# EAGLE design -Z_Panel_FM_Ver3 (EAGLE 9.6.2)
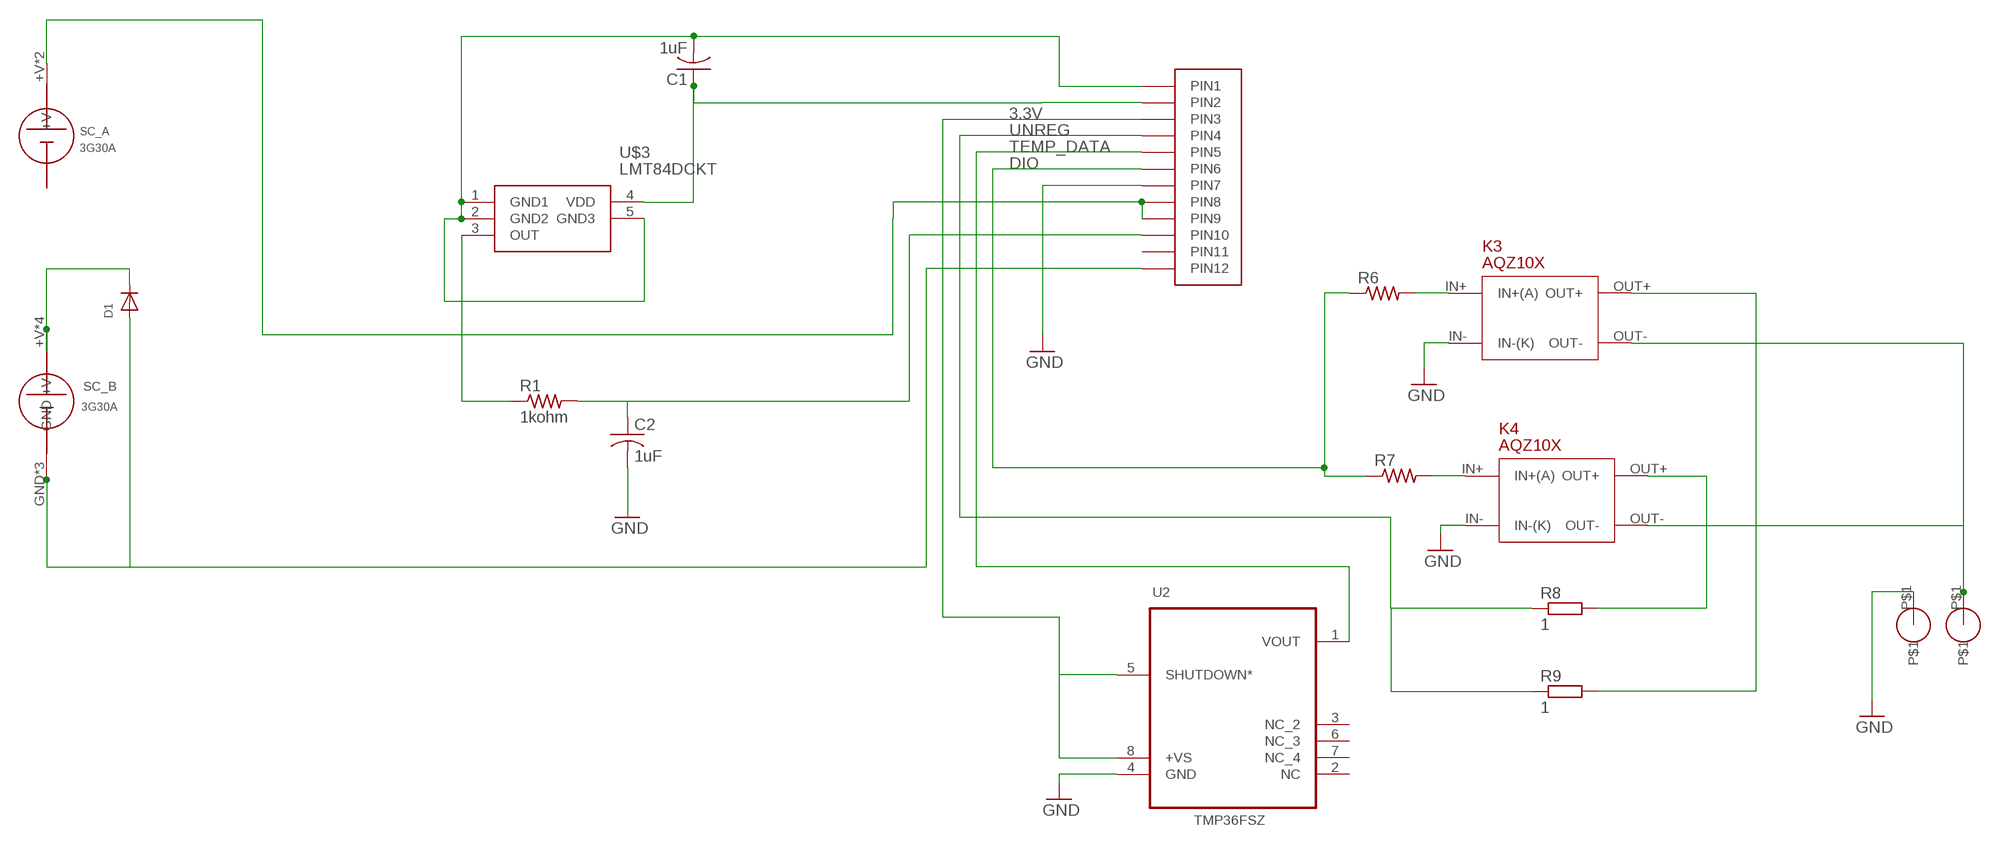
[diagram p0: schematic, sheet 1]

## Parts
C1  1uF  C-USC0805  [C0805]
C2  1uF  C-USC0805  [C0805]
D1  DIODE_SOD-123FL  [SOD-123FL]
GND9  NICR_HOLE  [NICR_HOLE]
HOLE1  NICR_HOLE  [NICR_HOLE]
K3  AQZ10X  [AQZ10X]
K4  AQZ10X  [AQZ10X]
R1  1kohm  R-US_R0402  [R0402]
R6  R-US_R0402  [R0402]
R7  R-US_R0402  [R0402]
R8  1  R-EU_R1218  [R1218]
R9  1  R-EU_R1218  [R1218]
U2  TMP36FSZ  [SOIC_N]
U$1  HEADER12PIN  [HEADER12PIN]
U$3  LMT84DCKT  [SOT65P210X110-5N]
U$4  SC_A  [SC_A]
U$5  SC_B  [SC_B]

## Nets
3.3V: U2.5(SHUTDOWN*) U2.8(+VS) U$1.P3(PIN3)
+V: U$1.P8(PIN8) U$1.P9(PIN9) U$4.+V U$4.+V1(+V)
+VB: D1.C U$5.+V U$5.+V2(+V) U$5.+V3(+V) U$5.+V4(+V)
DIO: R6.1 R7.1 U$1.P6(PIN6)
GND: C1.2 C2.2 D1.A GND9.P$1 K3.IN-(IN-(K)) K4.IN-(IN-(K)) U2.4(GND) U$1.P1(PIN1) U$1.P7(PIN7) U$1.P12(PIN12) U$3.1(GND1) U$3.2(GND2) U$3.5(GND3) U$5.GND U$5.GND1(GND) U$5.GND2(GND)
N$1: C2.1 R1.2 U$1.P10(PIN10)
N$2: C1.1 U$1.P2(PIN2) U$3.4(VDD)
N$6: K3.IN+(IN+(A)) R6.2
N$7: K4.IN+(IN+(A)) R7.2
N$8: K3.OUT+ R9.2
N$9: K4.OUT+ R8.2
N$10: R1.1 U$3.3(OUT)
N$11: HOLE1.P$1 K3.OUT- K4.OUT-
TEMP_DATA: U2.1(VOUT) U$1.P5(PIN5)
UNREG: R8.1 R9.1 U$1.P4(PIN4)
Unconnected: U2.2(NC) U2.3(NC_2) U2.6(NC_3) U2.7(NC_4) U$1.P11(PIN11)

## Library data of the parts
C1 C2 = adafruit:C-US: CAPACITOR, American symbol
D1 = adafruit:DIODE: Diode SMADIODE - SMA Surface Mount Package 20V 1A Schottky Diode Digikey: 641-1014-6-ND DO-1N4148 - Through Hole Small Current Diode SOD-123 20V 1 A (.5mV Vf) Schottky Diode - Digikey: MBRX120TPMSCT-ND SOD-323 10V 570mA (.38mV Vf, 3ns) Schottky Diode - Digikey: ZLLS410CT-ND SOD-523 30V 30mA Schottky Diode (RB751S-40TE61) - Digikey: RB751S-40TE61CT-ND SOT23-R/W - SOT23 Package (R = Solder Paste/Reflow Ovens, W = Hand-Soldering) BAT54Film 40V 300mA - Digikey: 497-7162-1-ND
GND9 HOLE1 = Nicr_hole:NICR_HOLE
K3 K4 = b4_photomos:AQZ10X
R1 = adafruit:R-US_: RESISTOR, American symbol
R6 R7 = adafruit_ufl:R-US_: RESISTOR, American symbol
R8 R9 = rcl:R-EU_: RESISTOR, European symbol; SPICEPREFIX: R
U2 = TMP36FSZ:TMP36FSZ
U$1 = BIRDS:HEADER12PIN
U$3 = LMT84DCKT:LMT84DCKT: 1.5V-Capable, 10 uA Analog Output Temperature Sensor in SC70 and TO-92 Source: Datasheet <http://uk.rs-online.com/web/p/products/8115860>; DESCRIPTION: 1.5V-Capable, 10 uA Analog Output Temperature Sensor in SC70 and TO-92; HEIGHT: 1.1mm; MANUFACTURER_NAME: Texas Instruments; MANUFACTURER_PART_NUMBER: LMT84DCKT; RS_PART_NUMBER: 8115860
U$4 = SC_A:SC_A
U$5 = SC_B:SC_B

## Board
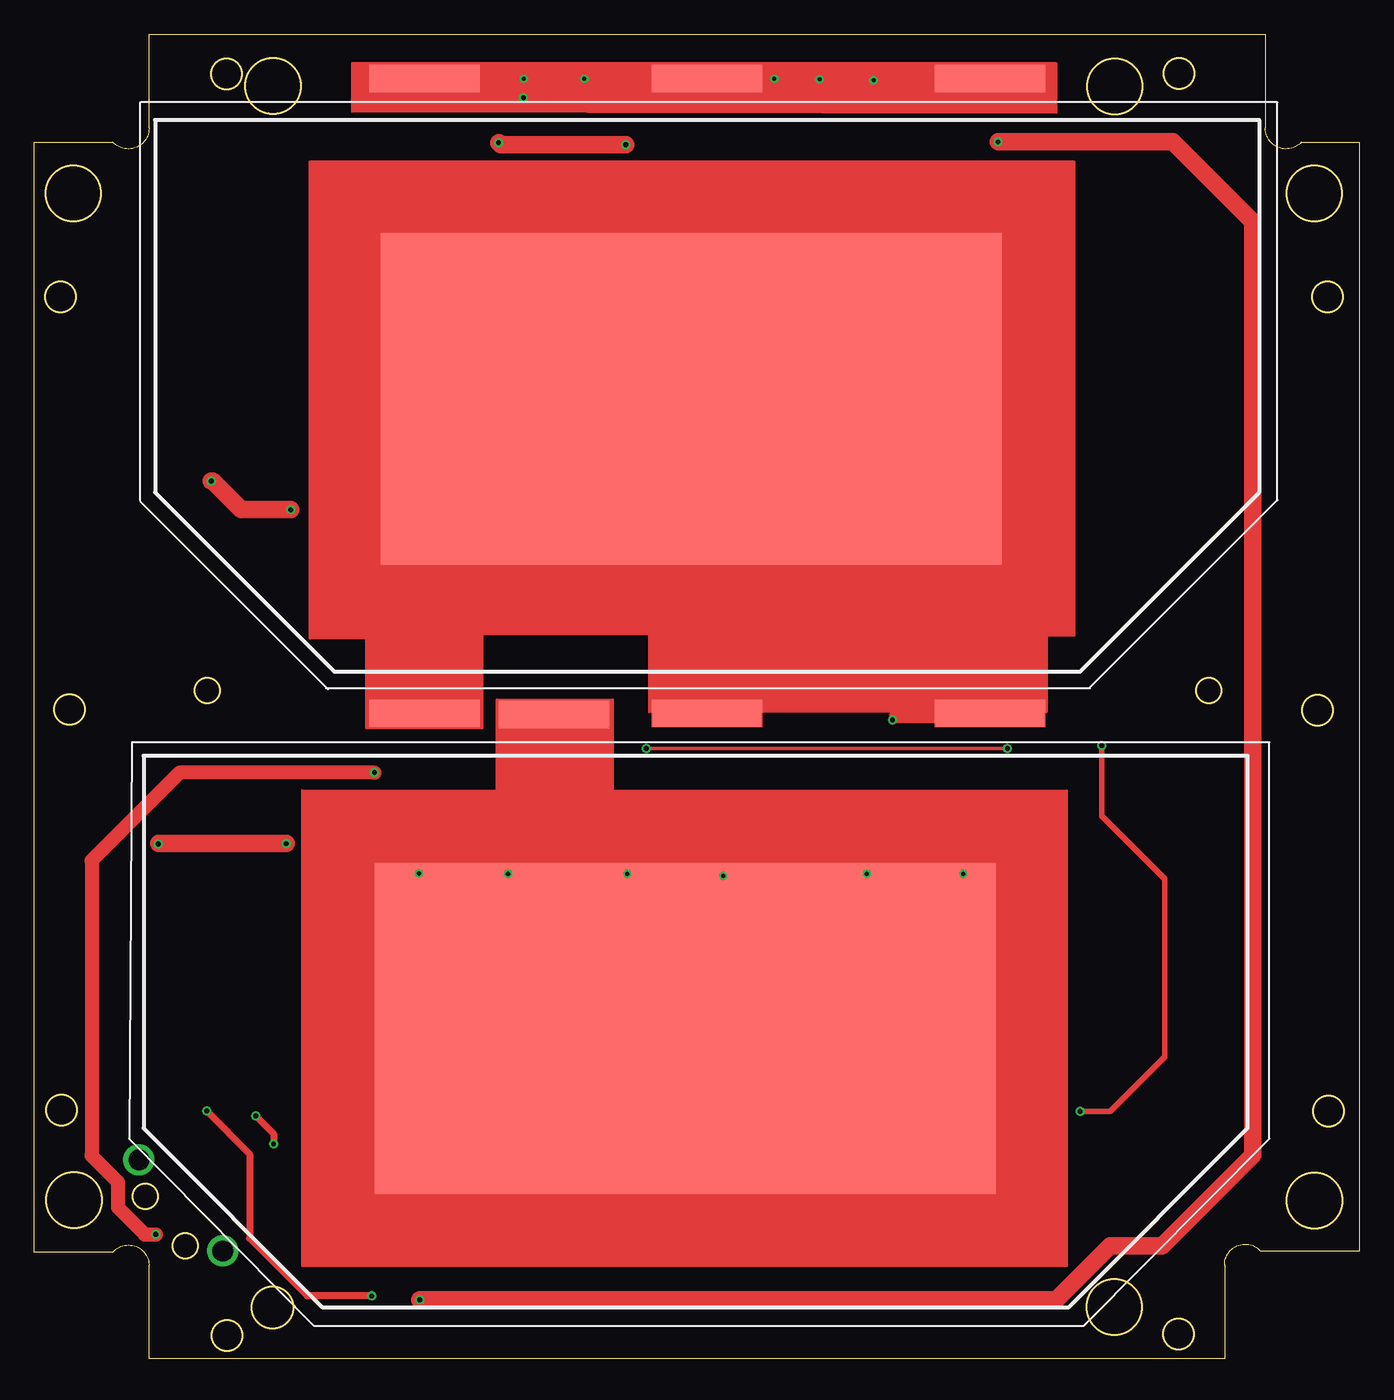
[diagram p1: board, top side]
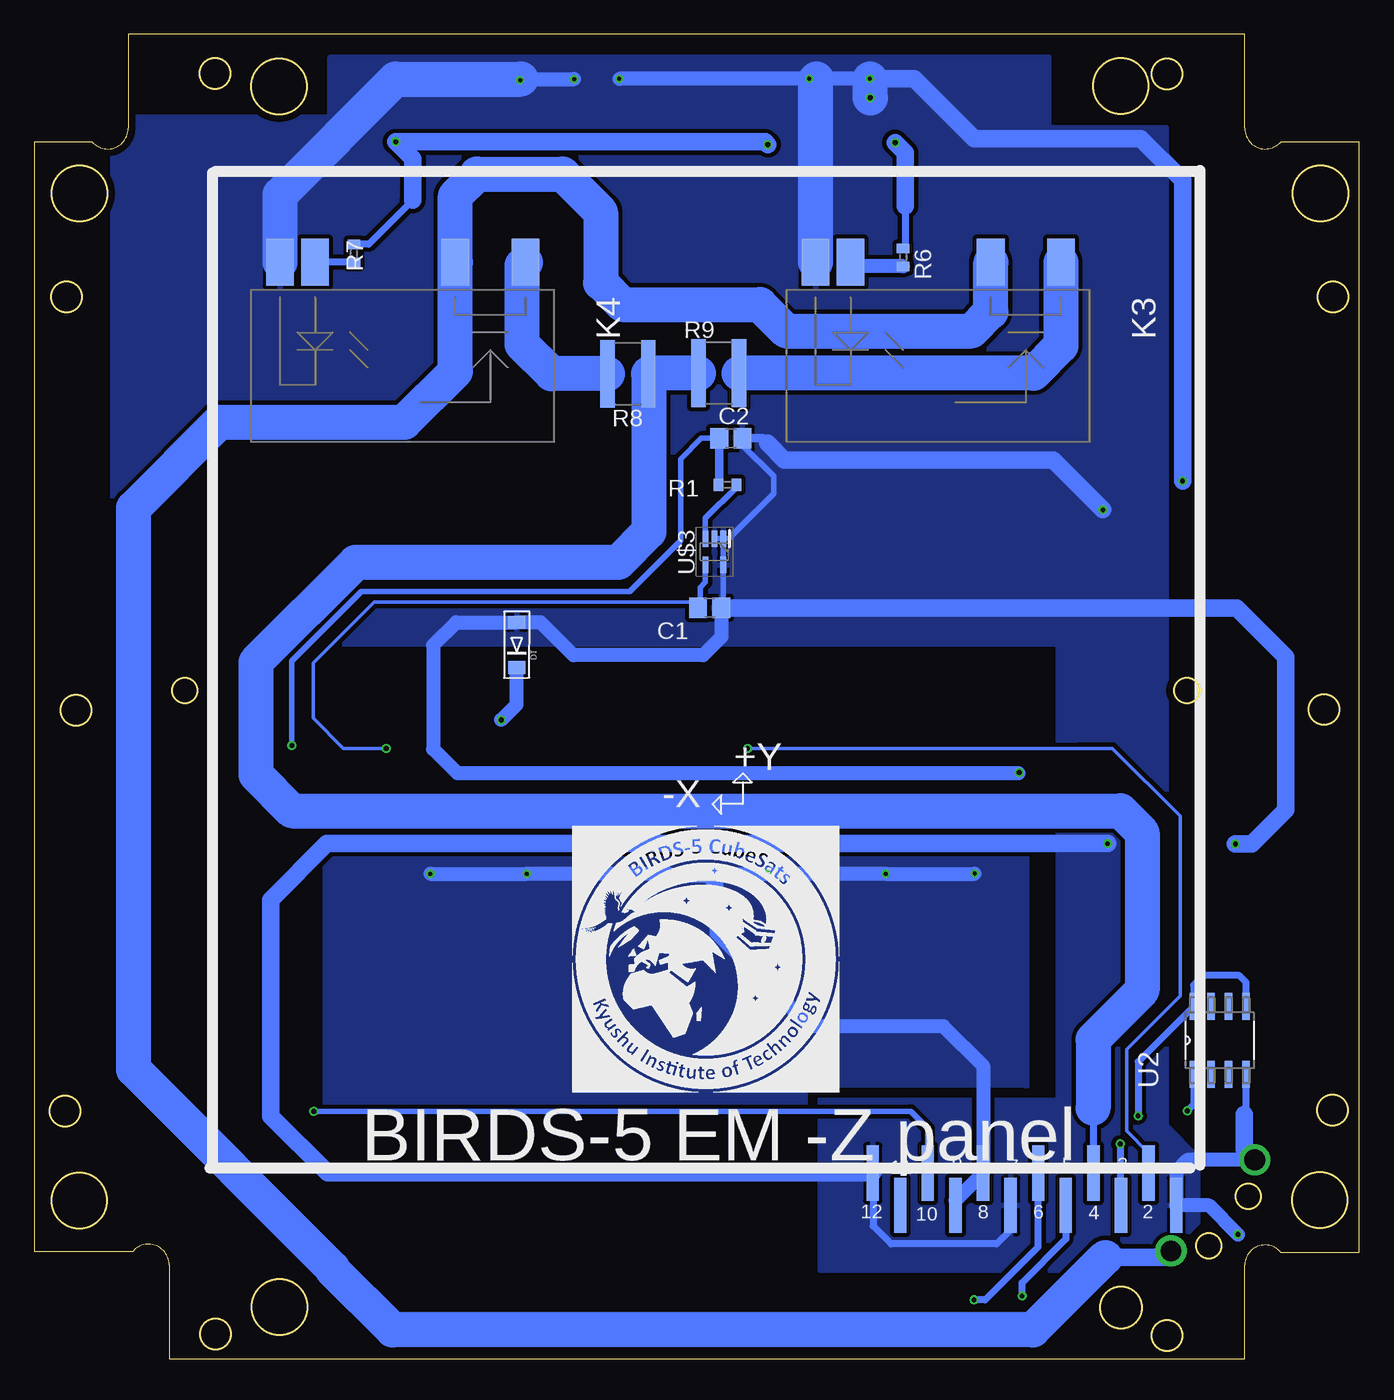
[diagram p2: board, bottom side, seen from below]

Size 96 x 96 mm. Coordinates in mm from the lower left corner, seen from the top.
Outline: 91.82,88.2 96,88.2 96,7.8 88.86,7.8 arc138 86.24,6.8 86.24,0 8.3,0 8.3,6.8 arc138 5.68,7.71 0,7.71 0,88.2 5.68,88.2 arc138 8.3,89.2 8.3,96 89.2,96 89.2,89.2 arc138 91.82,88.2
Outline: circle at 12.51,48.45 radius 0.9
Outline: circle at 8.03,11.78 radius 0.9
Outline: circle at 78.25,3.75 radius 2
Outline: circle at 17.26,3.73 radius 1.5
Outline: circle at 2.86,11.51 radius 2
Outline: circle at 2.55,47.07 radius 1.1
Outline: circle at 10.91,8.2 radius 0.9
Outline: circle at 1.88,76.98 radius 1.1
Outline: circle at 92.76,11.47 radius 2
Outline: circle at 82.93,93.16 radius 1.1
Outline: circle at 93.7,76.99 radius 1.1
Outline: circle at 1.94,18.04 radius 1.1
Outline: circle at 93.79,17.95 radius 1.1
Outline: circle at 92.74,84.48 radius 2
Outline: circle at 13.94,1.7 radius 1.1
Outline: circle at 17.27,92.27 radius 2
Outline: circle at 85.11,48.45 radius 0.9
Outline: circle at 2.81,84.49 radius 2
Outline: circle at 92.99,47.02 radius 1.1
Outline: circle at 13.92,93.14 radius 1.1
Copper layers (1*16): Top 0.035mm / dielectric 1.53mm / Bottom 0.035mm
Design rules "pban_5mil-l2": minimum track width 5mil, minimum drill 0.3mm, track to track 5mil, track to pad 0.229mm, pad to pad 5mil, via to via 5mil, smd to smd 5mil, copper to edge 0.5mm, drill to drill 0.5mm, minimum pad ring 0.15mm, minimum via ring 0.15mm, stop-mask expansion 4mil, vias tented up to drill 0.35mm, thermal gap 10mil

### Footprints (pad centres in the part's own frame; a part is rotated, then mirrored left to right if it is on the bottom)
C0805 = smd 1.3 x 1.5: 1 -0.85,0; 2 0.85,0
SOD-123FL = smd 0.91 x 1.22 bottom: A 1.637,0; C -1.637,0
NICR_HOLE = drill 1.5 pad 1.75: P$1 0,0
AQZ10X = smd 3.4 x 2: IN+ 0,-6.35; IN- 0,-8.89; OUT+ 0,8.89; OUT- 0,3.81
R0402 = smd 0.7 x 0.9: 1 -0.65,0; 2 0.65,0
R1218 = smd 1.05 x 4.9: 1 -1.475,0; 2 1.475,0
SOIC_N = smd 1.981 x 0.559: 1 -2.464,1.905; 2 -2.464,0.635; 3 -2.464,-0.635; 4 -2.464,-1.905; 5 2.464,-1.905; 6 2.464,-0.635; 7 2.464,0.635; 8 2.464,1.905
HEADER12PIN = smd 4 x 0.89: P1 0,0; P2 2.35,2; P3 0,4; P4 2.35,6; P5 0,8; P6 2.35,10; P7 0,12; P8 2.35,14; P9 0,16; P10 2.35,18; P11 0,20; P12 2.35,22
SOT65P210X110-5N = smd 1.2 x 0.4: 1 -0.95,0.65; 2 -0.95,0; 3 -0.95,-0.65; 4 0.95,-0.65; 5 0.95,0.65
SC_A = smd 45 x 24: +V 40.75,19.75 | smd 8 x 2: +V1 50.25,-3
SC_B = smd 45 x 24: +V 41.14,20.22 | smd 8 x 2: +V2 19.5,43; +V3 40,43; +V4 60.5,43; GND 60.5,-3; GND1 19.5,-3; GND2 40,-3

### Placement (x,y rotation side)
C1  47.07,54.43 0 bottom
C2  45.54,66.73 0 bottom
D1  61.06,51.74 90 top
GND9  7.56,14.41 0 top
HOLE1  13.64,7.81 0 top
K3  30.51,79.48 270 bottom
K4  69.32,79.48 270 bottom
R1  45.77,63.35 180 bottom
R6  33.05,79.84 270 bottom
R7  72.85,80.14 270 bottom
R8  53,71.4 180 bottom
R9  46.41,71.45 0 bottom
U2  10.1,23.08 90 bottom
U$1  13.26,11.11 90 bottom
U$3  46.74,58.5 270 bottom
U$4  87.9,43.7 180 top
U$5  88.75,89.8 180 top

### Tracks (layer width: path | path; a pad name or v marks a point on that pad's centre or on a via)
3.3V  (via drill 0.35)
  Top 0.508: v16.03,17.6 17.32,16.31 v17.32,15.57
  Bottom 0.152: 17.32,11.17 U$1.P3
  Bottom 0.508: U2.5 8.2,27.3 8.69,27.79 11.3,27.79 12.01,27.08 U2.8 16.03,21.53 v16.03,17.6 | v17.32,15.57 17.32,11.17
+V  (via drill 0.3)
  Top 0.152: 39.57,27.99 42.95,31.37 v42.95,35.15 | U$4.+V 47.15,32.24 v49.91,35
  Top 1.016: U$4.+V1 37.65,29.91 39.57,27.99
  Bottom 0.152: 29.26,11.46 U$1.P9
  Bottom 1.016: 47.19,35 46.56,34.37 46.56,30.84 39.83,24.11 30.13,24.11 27.26,21.23 U$1.P8 29.26,11.46 | 47.19,35 47.32,35.13 42.98,35.13 v42.95,35.15 42.85,35.15 42.82,35.18 34.44,35.18 34.42,35.15 v34.31,35.15 27.89,35.15 v27.86,35.18 | 47.19,35 v49.91,35 50.06,35.15 v60.33,35.15 v67.31,35.15
  pour Bottom (isolate 0.305): 40.13,6.53 40.13,19.79 40.21,19.86 24.21,19.86 24.1,19.76 24.1,41.35 74.93,41.35 74.93,6.53
+VB  (via drill 0.35)
  Top 0.152: U$5.+V 47.61,68.06 46.61,67.06 | v62.18,46.3 62.45,46.57
  Top 1.016: U$5.+V3 46.61,48.94 46.61,67.06 | U$5.+V4 28.25,52.66 39.21,63.62 48.75,54.08 U$5.+V3 | U$5.+V3 49.41,47.46 52.24,47.46 53.54,48.77 53.54,55.93 60.45,49.02 61.39,49.02 62.36,49.99 62.36,54.83 58.37,58.82 58.37,57.68 U$5.+V2 69.02,46.57 62.45,46.57
  Bottom 1.016: v62.18,46.3 61.06,47.43 D1.C
DIO  (via drill 0.35)
  Top 1.27: v27.91,4.27 74.04,4.27 77.95,8.18 81.71,8.18 88.29,14.76 88.29,82.42 82.5,88.21 v69.83,88.21 | v42.85,88.01 33.78,88.01 v33.63,88.16
  Bottom 0.508: v27.91,4.27 27.1,4.27 26.15,5.22 23.26,8.11 U$1.P6 | 68.61,83.97 71.79,80.79 R7.1 | 32.89,83.57 32.89,80.64 R6.1
  Bottom 1.27: 68.61,83.97 68.61,87 v69.83,88.21 43.05,88.21 v42.85,88.01 | v33.63,88.16 32.89,87.43 32.89,83.57
GND  (via drill 0.3, 0.35)
  Top 0.152: 35.45,92.8 v35.46,92.79 | 56.86,92.8 v56.9,92.76 | U$5.GND1 69.14,92.69 | 4.14,14.76 4.14,14.71 | v8.97,37.31 8.99,37.34
  Top 1.016: U$5.GND 35.45,92.8 | v39.85,92.79 39.86,92.78 48.73,92.78 U$5.GND2 v53.62,92.8 56.86,92.8 | v60.81,92.69 69.14,92.69 | v24.64,42.49 10.52,42.49 4.14,36.12 4.14,14.76 | v8.79,9.02 7.99,9.02 6.04,10.96 6.04,12.81 4.14,14.71
  Top 1.27: v18.57,61.54 14.99,61.54 12.9,63.63 v12.8,63.63 | v18.24,37.34 8.99,37.34
  Bottom 0.152: 53.61,92.79 v53.62,92.8 | 24.68,42.45 v24.64,42.49 | 11.76,11.12 11.76,10.87 | U$1.P12 35.22,13.42 | U2.4
  Bottom 0.406: U$3.1 U$3.2 | C2.2 44.69,66.24 42.43,63.98 42.43,62.72 45.7,59.45 U$3.1 | U$3.1 U$3.5 46.09,54.56 C1.2
  Bottom 0.508: U$1.P7 25.26,9.34 26.28,8.32 33.92,8.32 35.22,9.62 35.22,13.42 | U2.4 8.2,17.83 8.32,17.71
  Bottom 0.61: C2.2 43.23,66.73 42.88,66.37
  Bottom 1.016: v35.46,92.79 36.25,92.79 39.32,92.79 v39.85,92.79 53.61,92.79 | v56.9,92.76 60.73,92.76 v60.81,92.69 | C1.2 46.22,52.34 47.55,51 56.95,51 59.33,53.38 D1.A 65.45,53.38 67.11,51.73 67.11,44.2 65.36,42.45 24.68,42.45 | GND9.P$1 12.45,14.41 13.26,13.6 U$1.P1 10.88,11.11 v8.79,9.02
  Bottom 1.27: 42.88,66.37 41.66,65.15 22.17,65.15 v18.57,61.54 | v12.8,63.63 12.8,85.42 15.82,88.44 27.91,88.44 32.26,92.79 36.25,92.79 | C1.2 8.88,54.43 5.31,50.86 5.31,39.78 7.77,37.31 v8.97,37.31 | v18.24,37.34 74.8,37.34 78.87,33.27 78.87,17.58 74.75,13.46 U$1.P12 | 8.32,17.71 8.32,15.17 GND9.P$1
  Bottom 2.54: K4.IN- 78.21,84.4 69.85,92.76 60.73,92.76 | 39.32,92.79 39.4,92.71 K3.IN- | v35.46,92.79 35.46,91.44 v35.43,91.42
  pour Bottom (isolate 0.305): 22.5,94.28 22.5,89.33 22.58,89.26 14,89.26 14,16.87 11.68,14.55 11.68,9.91 12.9,8.69 14.91,8.69 17.2,6.4 39.04,6.4 39.04,18.62 39.14,18.72 21.82,18.72 21.82,51.71 21.92,51.82 90.32,51.82 90.32,89.99 74.6,89.99 74.6,94.28 74.55,94.34 22.5,94.34 22.48,94.31
N$1  (via drill 0.35)
  Top 0.406: v77.34,44.45 77.34,39.34 81.92,34.77 81.92,21.89 77.95,17.93 v75.77,17.93
  Bottom 0.152: 46.37,63.4 R1.2
  Bottom 0.406: C2.1 47.68,66.73 49.17,65.23 49.17,59.31 52.86,55.63 72.31,55.63 77.34,50.6 v77.34,44.45 | v75.77,17.93 32.51,17.93 31.26,16.69 U$1.P10
  Bottom 0.61: C2.1 46.37,66.7 46.37,63.4
N$2  (via drill 0.35)
  Top 0.254: v70.51,44.25 v44.32,44.25
  Bottom 0.152: 47.76,54.59 C1.1
  Bottom 0.254: C1.1 48.32,54.84 71.37,54.84 75.79,50.42 75.79,46.43 73.61,44.25 v70.51,44.25 | v44.32,44.25 20.32,44.25 20.22,44.25 17.88,44.25 12.98,39.34 12.98,26.31 16.86,22.43 16.86,16.5 15.26,14.9 U$1.P2
  Bottom 0.406: U$3.4 47.39,56.3 47.76,55.92 47.76,54.59
N$6
  Bottom 0.152: 36.86,79.2 K3.IN+
  Bottom 1.016: R6.2 36.85,79.19 36.86,79.2
N$7
  Bottom 0.508: R7.2 K4.IN+
N$8
  Bottom 2.54: K3.OUT+ 21.62,73.43 23.6,71.45 R9.2
N$9
  Bottom 2.54: R8.2 58.52,71.4 60.66,73.53 60.66,79.25 K4.OUT+
N$10
  Bottom 0.406: R1.1 45.12,63.2 47.39,60.93 U$3.3
N$11
  Bottom 1.27: HOLE1.P$1 14.11,7.34 18.39,7.34
  Bottom 2.54: K3.OUT- 26.7,75.89 28.09,74.5 41.5,74.5 43.43,76.43 53.39,76.43 54.97,78 54.97,83.11 57.73,85.88 63.93,85.88 65.51,84.3 K4.OUT- 65.51,71.58 69.19,67.89 82.6,67.89 88.82,61.67 88.82,20.97 74.41,6.55 74.41,6.44 70.05,2.08 23.65,2.08 18.39,7.34
TEMP_DATA  (via drill 0.35)
  Top 0.508: v12.47,17.96 15.6,14.83 15.6,8.71 19.75,4.56 v24.42,4.56 v24.43,4.55
  Bottom 0.508: U2.1 12.01,18.42 v12.47,17.96 | v24.43,4.55 24.43,5.51 21.26,8.69 U$1.P5
UNREG
  Bottom 0.152: 19.25,23.18 19.28,23.15 | 19.28,13.48 U$1.P4
  Bottom 0.508: 19.28,18.16 19.28,13.48
  Bottom 2.54: R9.1 51.47,71.45 | R8.1 51.47,71.45 | 51.47,71.45 51.47,59.96 53.7,57.73 72.72,57.73 79.96,50.49 79.96,42.34 77.34,39.73 17.3,39.73 15.72,38.15 15.72,26.7 19.25,23.18 | 19.28,23.15 19.28,18.16

### Text on the board
bPlace: +Y | -X | C:/Users/Derrick Tebusweke/Desktop/New White and Black - BIRDS5 logo for EM (1).bmp | BIRDS-5 EM -Z panel
bNames: 3 | 5 | 9 | 7 | 11 | 2 | 4 | 6 | 8 | 10 | 12